# EAGLE design Front_panel_owon_ver_mini (EAGLE 9.5.2)
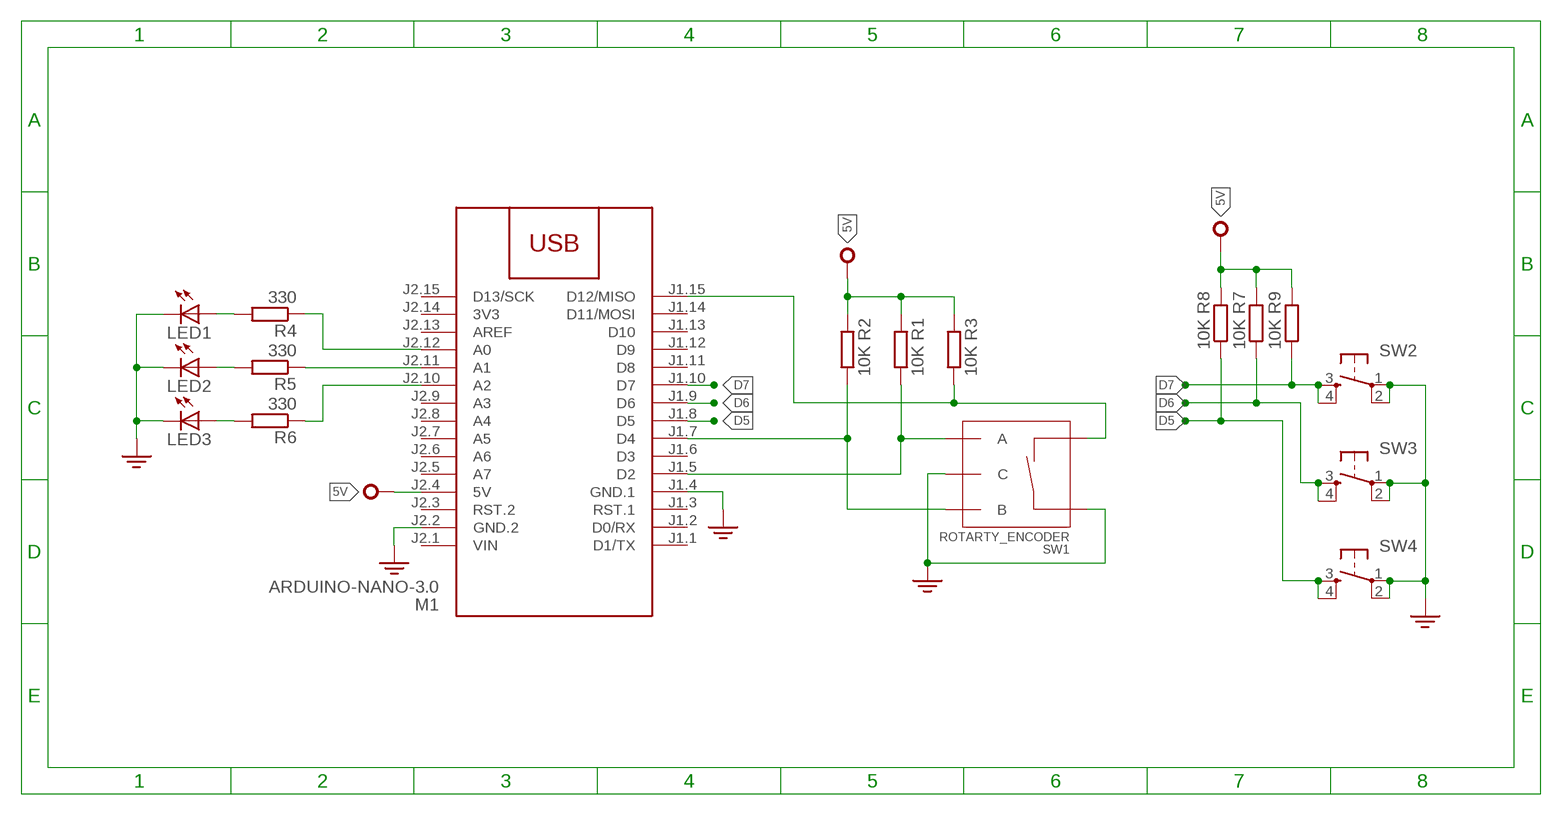
[diagram p0: schematic, sheet 1]

## Parts
LED1  LED5MM  [LED5MM]
LED2  LED5MM  [LED5MM]
LED3  LED5MM  [LED5MM]
M1  ARDUINO-NANO-3.0  [ARDUINO-NANO-3.0]
R1  10K  R-EU_0204/7  [0204/7]
R2  10K  R-EU_0204/7  [0204/7]
R3  10K  R-EU_0204/7  [0204/7]
R4  330  R-EU_0204/7  [0204/7]
R5  330  R-EU_0204/7  [0204/7]
R6  330  R-EU_0204/7  [0204/7]
R7  10K  R-EU_0204/7  [0204/7]
R8  10K  R-EU_0204/7  [0204/7]
R9  10K  R-EU_0204/7  [0204/7]
SW1  ROTARTY_ENCODER  [ROTARY_ENC_PLAIN]
SW2  TACTILE-SWITCH-PTH  [TAC-SWITCH-PTH]
SW3  TACTILE-SWITCH-PTH  [TAC-SWITCH-PTH]
SW4  TACTILE-SWITCH-PTH  [TAC-SWITCH-PTH]

## Nets
5V: M1.J2.4(5V) R1.2 R2.2 R3.2 R7.2 R8.2 R9.2 ; supply symbol labelled PWR_VIN
D2: M1.J1.5(D2) R1.1 SW1.A
D4: M1.J1.7(D4) R2.1 SW1.B
D5: M1.J1.8(D5) R8.1 SW4.3 SW4.4
D6: M1.J1.9(D6) R7.1 SW3.3 SW3.4
D7: M1.J1.10(D7) R9.1 SW2.3 SW2.4
D12: M1.J1.15(D12/MISO) R3.1 SW1.SW-
GND: LED1.K(C) LED2.K(C) LED3.K(C) M1.J1.4(GND.1) M1.J2.2(GND.2) SW1.C SW1.SW+ SW2.1 SW2.2 SW3.1 SW3.2 SW4.1 SW4.2 ; supply symbol labelled GND2
N$1: M1.J2.11(A1) R5.1
N$2: LED1.A R4.2
N$3: LED2.A R5.2
N$4: LED3.A R6.2
N$5: M1.J2.12(A0) R4.1
N$6: M1.J2.10(A2) R6.1
Unconnected: M1.J1.1(D1/TX) M1.J1.2(D0/RX) M1.J1.3(RST.1) M1.J1.6(D3) M1.J1.11(D8) M1.J1.12(D9) M1.J1.13(D10) M1.J1.14(D11/MOSI) M1.J2.3(RST.2) M1.J2.5(A7) M1.J2.6(A6) M1.J2.7(A5) M1.J2.8(A4) M1.J2.9(A3) M1.J2.13(AREF) M1.J2.15(D13/SCK)

## Power pins joined to a net without a drawn wire
3V3: M1.J2.14(3V3)
VIN: M1.J2.1(VIN)

## Library data of the parts
LED1-LED3 = adafruit:LED: LED OSRAM: - CHIPLED LG R971, LG N971, LY N971, LG Q971, LY Q971, LO R971, LY R971 LH N974, LH R974 LS Q976, LO Q976, LY Q976 LO Q996 - Hyper CHIPLED LW Q18S LB Q993, LB Q99A, LB R99A - SideLED LS A670, LO A670, LY A670, LG A670, LP A670 LB A673, LV A673, LT A673, LW A673 LH A674 LY A675 LS A676, LA A676, LO A676, LY A676, LW A676 LS A679, LY A679, LG A679 - Hyper Micro SIDELED® LS Y876, LA Y876, LO Y876, LY Y876 LT Y87S - SmartLED LW L88C, LW L88S LB L89C, LB L89S, LG L890 LS L89K, LO L89K, LY L89K LS L896, LA L896, LO L896, LY L896 - TOPLED LS T670, LO T670, LY T670, LG T670, LP T670 LSG T670, LSP T670, LSY T670, LOP T670, LYG T670 LG T671, LOG T671, LSG T671 LB T673, LV T673, LT T673, LW T673 LH T674 LS T676, LA T676, LO T676, LY T676, LB T676, LH T676, LSB T676, LW T676 LB T67C, LV T67C, LT T67C, LS T67K, LO T67K, LY T67K, LW E67C LS E67B, LA E67B, LO E67B, LY E67B, LB E67C, LV E67C, LT E67C LW T67C LS T679, LY T679, LG T679 LS T770, LO T770, LY T770, LG T770, LP T770 LB T773, LV T773, LT T773, LW T773 LH T774 LS E675, LA E675, LY E675, LS T675 LS T776, LA T776, LO T776, LY T776, LB T776 LHGB T686 LT T68C, LB T68C - Hyper Mini TOPLED® LB M676 - Mini TOPLED Santana® LG M470 LS M47K, LO M47K, LY M47K Source: http://www.osram.convergy.de/
M1 = diy-modules:ARDUINO-NANO-3.0: Arduino Nano 3.0 and compatible devices More details available here: https://www.arduino.cc/en/Main/ArduinoBoardNano Click here to find device on ebay.com <http://www.ebay.com/sch/arduino+nano>
R1-R9 = rcl:R-EU_: RESISTOR, European symbol; SPICEPREFIX: R
SW1 = SparkFun-Electromechanical:ROTARTY_ENCODER: Simple no LED rotary encoder Example: COM-09117
SW2-SW4 = GeekAmmo:TACTILE-SWITCH: Tactile Switch 4 Pins, SPST NO

## Board
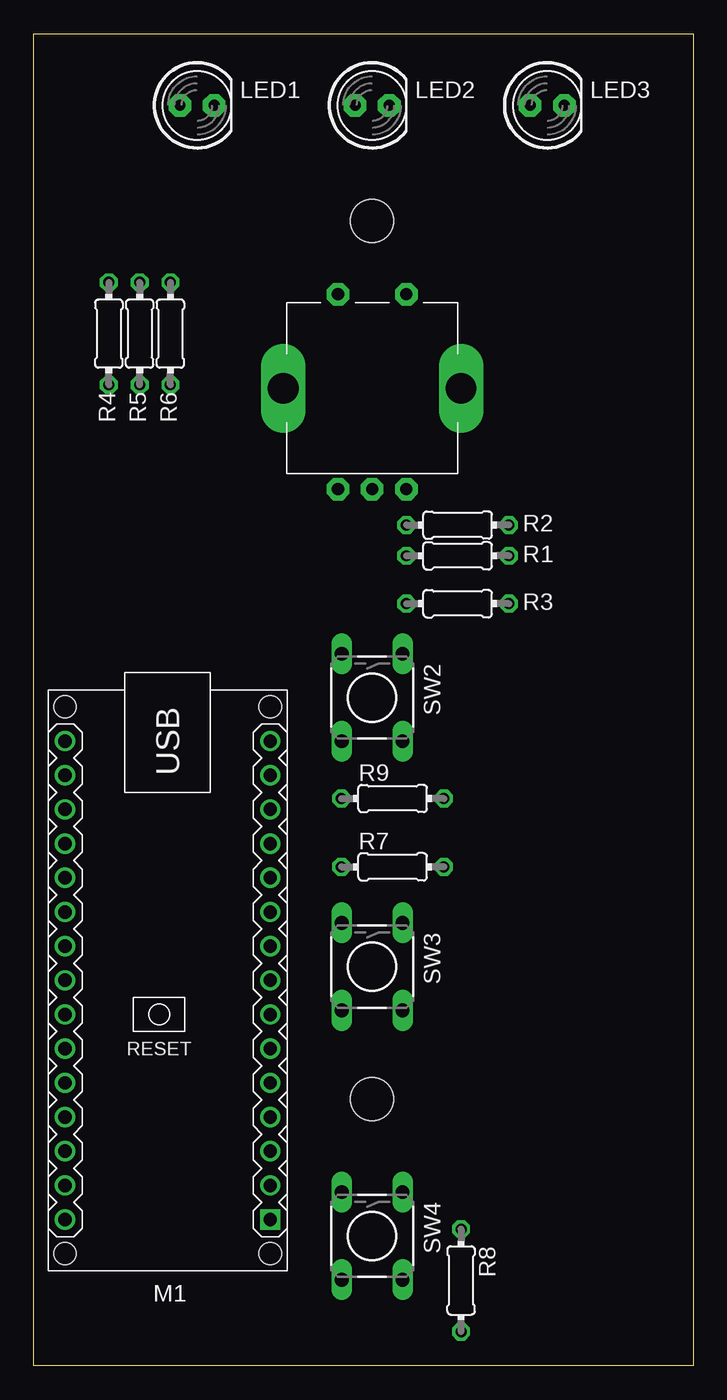
[diagram p1: board, top side]
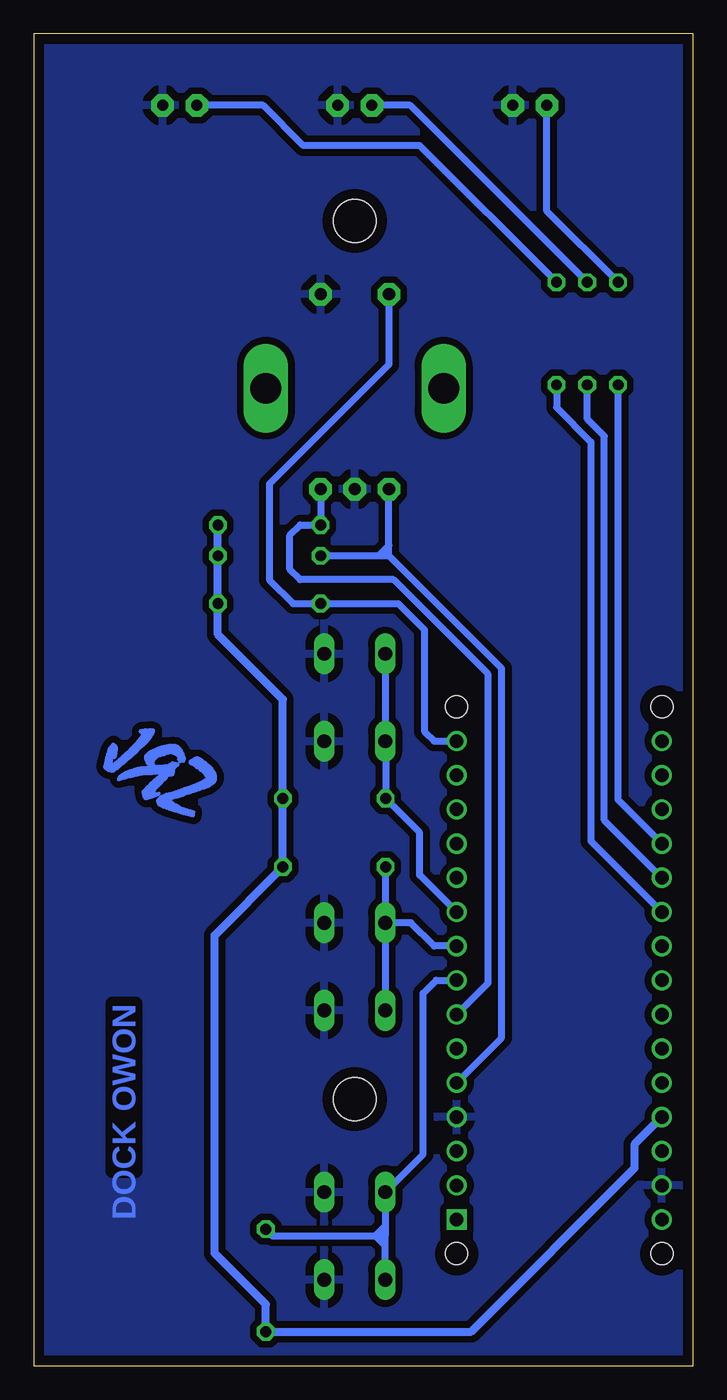
[diagram p2: board, bottom side, seen from below]

Size 49 x 99 mm. Coordinates in mm from the lower left corner, seen from the top.
Outline: 0,0 0,99 49,99 49,0 0,0
Copper layers (1*16): Top 0.035mm / dielectric 1.5mm / Bottom 0.035mm
Design rules "default *": minimum track width 6mil, minimum drill 0.35mm, track to track 0.5mm, track to pad 0.5mm, pad to pad 6mil, via to via 6mil, smd to smd 6mil, copper to edge 30mil, drill to drill 6mil, minimum pad ring 10mil, minimum via ring 8mil, stop-mask expansion 4mil, vias tented up to drill 0mil, thermal gap 25mil
Holes 3.2 mm at 25.15,19.81 25.15,85.09

### Footprints (pad centres in the part's own frame; a part is rotated, then mirrored left to right if it is on the bottom)
LED5MM = drill 0.813 pad 1.676 octagon: A -1.27,0; K 1.27,0
ARDUINO-NANO-3.0 = drill 1 square: J1.1 17.78,7.62 | drill 1: J1.2 15.24,7.62; J1.3 12.7,7.62; J1.4 10.16,7.62; J1.5 7.62,7.62; J1.6 5.08,7.62; J1.7 2.54,7.62; J1.8 0,7.62; J1.9 -2.54,7.62; J1.10 -5.08,7.62; J1.11 -7.62,7.62; J1.12 -10.16,7.62; J1.13 -12.7,7.62; J1.14 -15.24,7.62; J1.15 -17.78,7.62; J2.1 17.78,-7.62; J2.2 15.24,-7.62; J2.3 12.7,-7.62; J2.4 10.16,-7.62; J2.5 7.62,-7.62; J2.6 5.08,-7.62; J2.7 2.54,-7.62; J2.8 0,-7.62; J2.9 -2.54,-7.62; J2.10 -5.08,-7.62; J2.11 -7.62,-7.62; J2.12 -10.16,-7.62; J2.13 -12.7,-7.62; J2.14 -15.24,-7.62; J2.15 -17.78,-7.62 | hole 1.651: -20.32,7.62; -20.32,-7.62; 20.32,-7.62; 20.32,7.62
0204/7 = drill 0.813 octagon: 1 -3.81,0; 2 3.81,0
ROTARY_ENC_PLAIN = drill 0.9 pad 1.676 octagon: A -2.54,-7.493; B 2.54,-7.493; C 0,-7.493; SW+ 2.54,6.985; SW- -2.54,6.985 | drill 2.286 long: P$3 6.604,0; P$4 -6.604,0
TAC-SWITCH-PTH = drill 1.016 pad 1.524 long: 1 -3.251,2.261; 2 3.251,2.261; 3 -3.251,-2.261; 4 3.251,-2.261

### Placement (x,y rotation side)
LED1  12.14,93.68 0 top
LED2  25.15,93.68 0 top
LED3  38.15,93.68 0 top
M1  9.96,28.65 270 top
R1  31.5,60.2 0 top
R2  31.5,62.48 0 top
R3  31.5,56.64 0 top
R4  5.59,76.71 90 top
R5  7.87,76.71 90 top
R6  10.16,76.71 90 top
R7  26.67,37.08 0 top
R8  31.75,6.35 270 top
R9  26.67,42.16 0 top
SW1  25.15,72.64 0 top
SW2  25.15,49.66 270 top
SW3  25.15,29.67 270 top
SW4  25.15,9.65 270 top
U$1  [LOGO_B]  39.12,43.94 33 top

### Tracks (layer width: path | path; a pad name or v marks a point on that pad's centre or on a via)
5V
  Bottom 0.61: R2.2 R1.2 R3.2 35.31,54.36 30.48,49.53 R9.2 R7.2 35.56,32 35.56,8.38 31.75,4.57 R8.2 16.51,2.54 4.37,14.68 4.37,16.46 M1.J2.4
D2
  Bottom 0.508: 22.61,60.2 22.61,60.96 | 22.61,60.96 SW1.A | M1.J1.5 14.23,24.38 14.23,51.82 22.61,60.2 | R1.1 23.37,60.2 | 23.37,60.2 22.61,60.2 | 23.37,60.2 22.61,60.96
D4
  Bottom 0.508: SW1.B R2.1 29.21,62.48 29.97,61.72 29.97,59.18 29.21,58.42 22.25,58.42 15.24,51.41 15.24,28.45 M1.J1.7
D5
  Bottom 0.508: 22.89,9.65 SW4.4 22.89,8.91 23.62,9.65 | M1.J1.8 19.1,28.65 20.07,27.69 20.07,15.72 SW4.3 | R8.1 31.24,9.65 23.62,9.65 | SW4.3 22.89,9.65 | 23.62,9.65 22.89,9.65 | SW4.3 22.89,10.39 23.62,9.65
D6
  Bottom 0.508: M1.J1.9 19.25,31.19 20.98,32.92 SW3.3 | SW3.3 SW3.4 | SW3.3 22.86,32.94 R7.1
D7
  Bottom 0.508: M1.J1.10 20.32,36.47 20.32,39.62 R9.1 22.86,46.38 SW2.4 SW2.3
D12
  Bottom 0.508: SW1.SW- 22.61,74.42 31.49,65.54 31.49,58.41 29.72,56.64 R3.1 21.9,56.64 19.97,54.71 19.97,47.15 19.25,46.43 M1.J1.15
GND
  pour Bottom (isolate 0.406): -1.78,100.58 51.82,100.58 51.82,-3.3 -1.78,-3.3
N$1
  Bottom 0.508: M1.J2.11 6.6,40.53 6.6,69.08 7.87,70.36 R5.1
N$2
  Bottom 0.508: R4.2 10.87,85.8 LED1.A
N$3
  Bottom 0.508: R5.2 21.03,93.67 LED2.A
N$4
  Bottom 0.508: R6.2 20.32,90.68 28.96,90.68 31.95,93.67 LED3.A
N$5
  Bottom 0.508: R4.1 5.59,42.06 M1.J2.12
N$6
  Bottom 0.508: R6.1 10.16,71.22 7.6,68.66 7.6,39 M1.J2.10

### Text on the board
Bottom: DOCK OWON